# EAGLE design gateway (EAGLE 9.1.1)
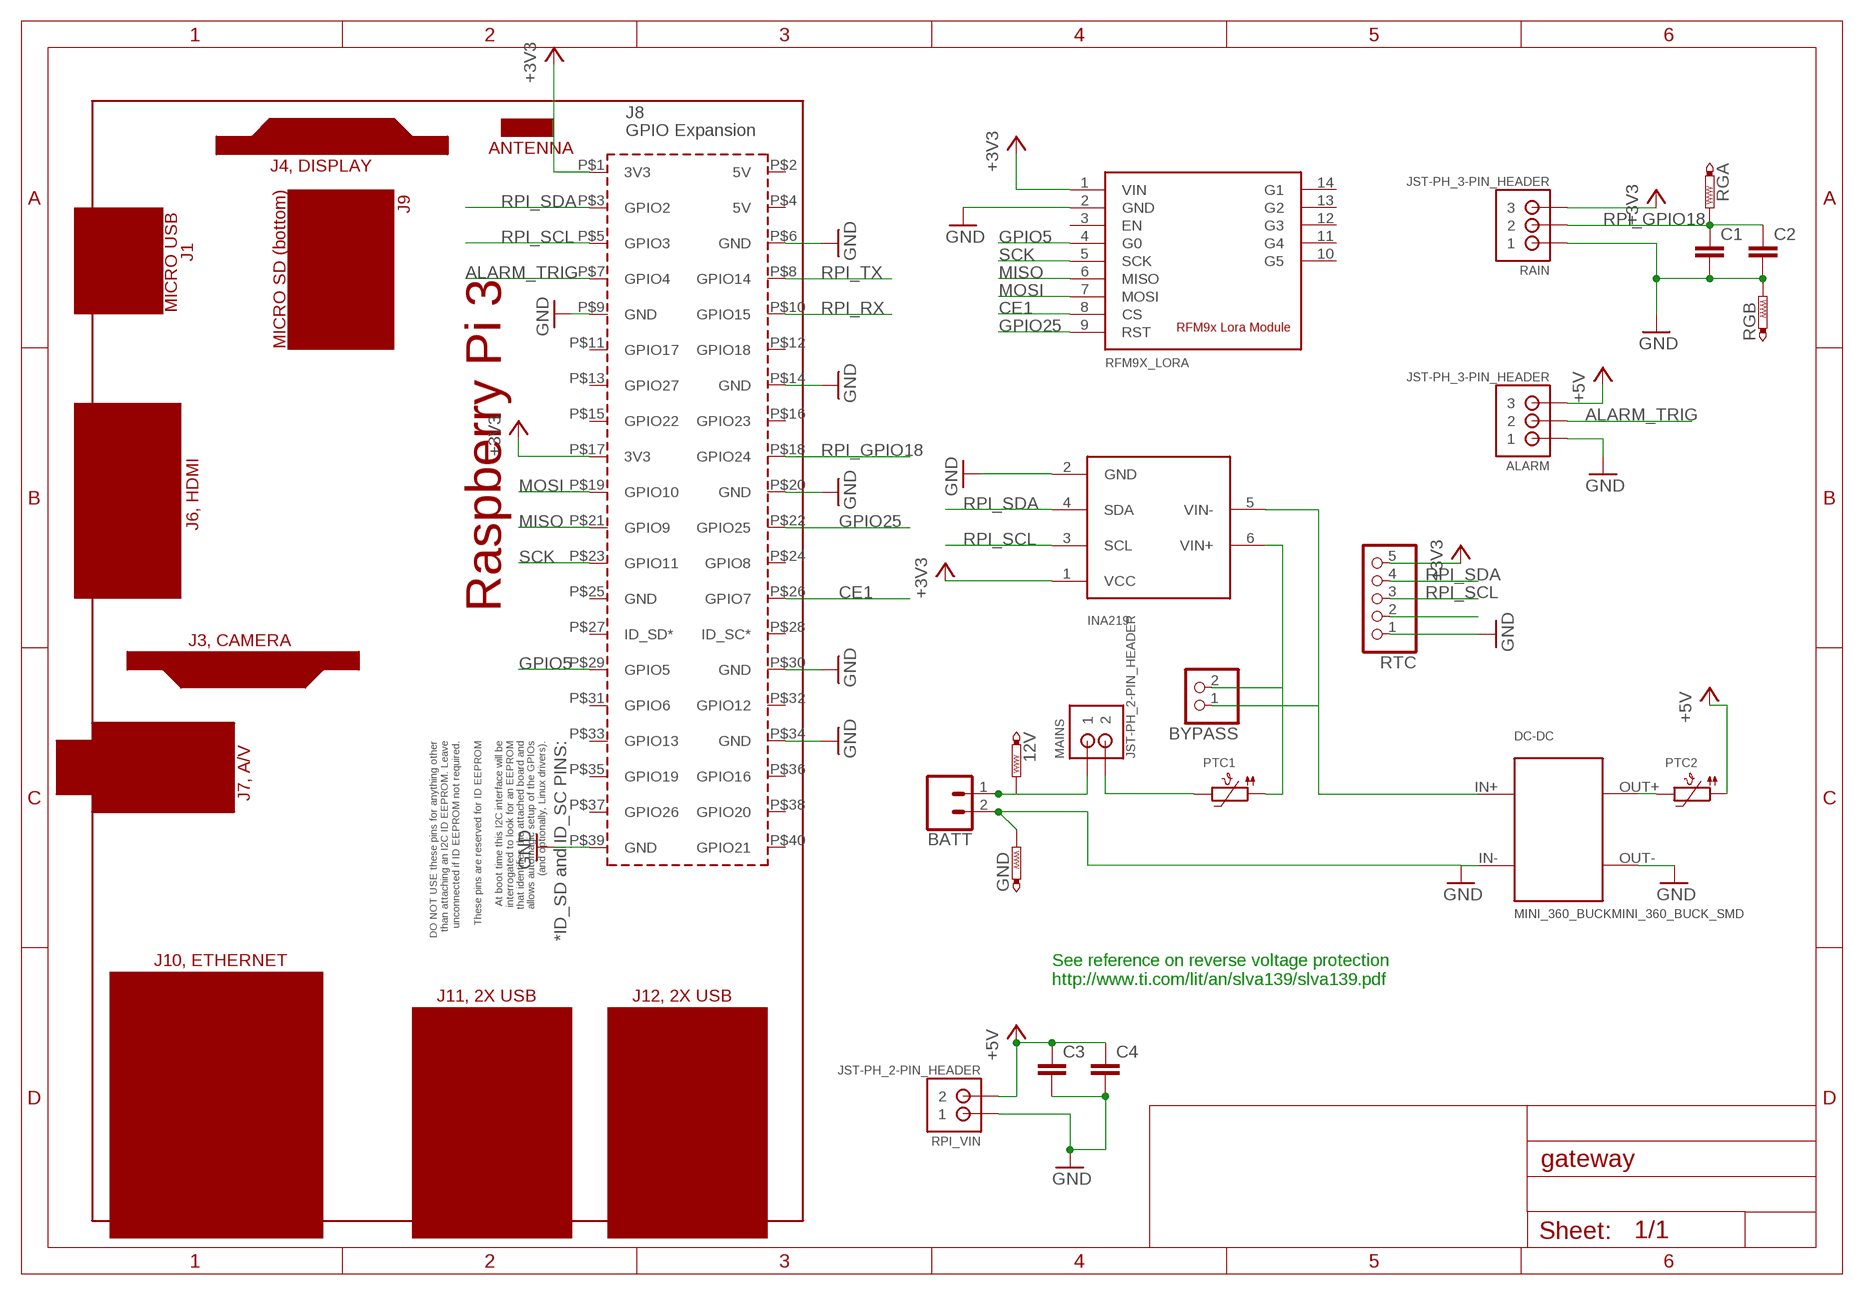
[diagram p0: schematic, sheet 1]

## Parts
12V  PTR1PAD1-13  [P1-13]
ALARM  JST-PH_3-PIN_HEADER  [JST_B3B-PH_HEADER]
BATT  CONN_02POLAR  [MOLEX-1X2]
BYPASS  PINHD-1X2  [1X02]
C1  C-EUC0805  [C0805]
C2  C-EUC0805  [C0805]
C3  C-EUC1210  [C1210]
C4  C-EUC2012  [C2012]
DC-DC  MINI_360_BUCKMINI_360_BUCK_SMD  [MINI_360_BUCK_SMD]
GND  PTR1PAD1-13  [P1-13]
INA219  INA219  [INA219]
MAINS  JST-PH_2-PIN_HEADER  [JST_B2B-PH_HEADER]
PCB2  RPI3  [RPI3]
PTC1  PTC1206  [1206]
PTC2  PTC1210  [PTC1210]
RAIN  JST-PH_3-PIN_HEADER  [JST_B3B-PH_HEADER]
RFM9X_LORA  RFM9X_MODULE  [RFM9X_MODULE]
RGA  PTR1PAD1-13  [P1-13]
RGB  PTR1PAD1-13  [P1-13]
RPI_VIN  JST-PH_2-PIN_HEADER  [JST_B2B-PH_HEADER]
RTC  PINHD-1X5  [1X05]

## Nets
+3V3: INA219.1(VCC) PCB2.P$1(3V3) PCB2.P$17(3V3) RAIN.P3 RFM9X_LORA.1(VIN) RTC.5
+5V: ALARM.P3 C3.1 C4.1 PTC2.P$1 RPI_VIN.P2
ALARM_TRIG: ALARM.P2 PCB2.P$7(GPIO4)
CE1: PCB2.P$26(GPIO7) RFM9X_LORA.8(CS)
GND: ALARM.P1 BATT.2 C1.2 C2.2 C3.2 C4.2 DC-DC.IN-(VIN-) DC-DC.OUT-(VOUT-) GND.TP INA219.2(GND) PCB2.P$6(GND) PCB2.P$9(GND) PCB2.P$14(GND) PCB2.P$20(GND) PCB2.P$30(GND) PCB2.P$34(GND) PCB2.P$39(GND) RAIN.P1 RFM9X_LORA.2(GND) RGB.TP RPI_VIN.P1 RTC.1
GPIO5: PCB2.P$29(GPIO5) RFM9X_LORA.4(G0)
GPIO25: PCB2.P$22(GPIO25) RFM9X_LORA.9(RST)
MISO: PCB2.P$21(GPIO9) RFM9X_LORA.6(MISO)
MOSI: PCB2.P$19(GPIO10) RFM9X_LORA.7(MOSI)
N$2: 12V.TP BATT.1 MAINS.P1
N$3: MAINS.P2 PTC1.2
N$4: RTC.2
N$5: BYPASS.1 DC-DC.IN+(VIN+) INA219.5(VIN-)
N$6: BYPASS.2 INA219.6(VIN+) PTC1.1
N$24: DC-DC.OUT+(VOUT+) PTC2.P$2
RPI_GPIO18: C1.1 C2.1 PCB2.P$18(GPIO24) RAIN.P2 RGA.TP
RPI_RX: PCB2.P$10(GPIO15)
RPI_SCL: INA219.3(SCL) PCB2.P$5(GPIO3) RTC.3
RPI_SDA: INA219.4(SDA) PCB2.P$3(GPIO2) RTC.4
RPI_TX: PCB2.P$8(GPIO14)
SCK: PCB2.P$23(GPIO11) RFM9X_LORA.5(SCK)
Unconnected: PCB2.P$2(5V) PCB2.P$4(5V) PCB2.P$11(GPIO17) PCB2.P$12(GPIO18) PCB2.P$13(GPIO27) PCB2.P$15(GPIO22) PCB2.P$16(GPIO23) PCB2.P$24(GPIO8) PCB2.P$25(GND) PCB2.P$27(ID_SD*) PCB2.P$28(ID_SC*) PCB2.P$31(GPIO6) PCB2.P$32(GPIO12) PCB2.P$33(GPIO13) PCB2.P$35(GPIO19) PCB2.P$36(GPIO16) PCB2.P$37(GPIO26) PCB2.P$38(GPIO20) PCB2.P$40(GPIO21) RFM9X_LORA.3(EN) RFM9X_LORA.10(G5) RFM9X_LORA.11(G4) RFM9X_LORA.12(G3) RFM9X_LORA.13(G2) RFM9X_LORA.14(G1)

## Notes on the sheet
- See reference on reverse voltage protection
  http://www.ti.com/lit/an/slva139/slva139.pdf

## Library data of the parts
12V GND RGA RGB = testpad:PTR1: TEST PIN
ALARM RAIN = SRG:JST-PH_3-PIN_HEADER: 3-pin JST PH Shrouded Header, top entry P/N B3B-PH-K-S Mating connector PHR-3
BATT = SparkFun-Connectors:CONN_02: Multi connection point. Often used as Generic Header-pin footprint for 0.1 inch spaced/style header connections On any of the 0.1 inch spaced packages, you can populate with these: Break Away Headers - Straight <https://www.sparkfun.com/products/116> (PRT-00116) Break Away Male Headers - Right Angle <https://www.sparkfun.com/products/553> (PRT-00553) Female Headers <https://www.sparkfun.com/products/115> (PRT-00115) Break Away Headers - Machine Pin <https://www.sparkfun.com/products/117> (PRT-00117) Break Away Female Headers - Swiss Machine Pin <https://www.sparkfun.com/products/743> (PRT-00743) For SCREWTERMINALS and SPRING TERMINALS visit here: Screw Terimnals on SparkFun.com <https://www.sparkfun.com/search/results?term=Screw+Terminals> (5mm/3.5mm/2.54mm spacing) This device is also useful as a general connection point to wire up your design to another part of your project. Our various solder wires solder well into these plated through hole pads. Hook-Up Wire - Assortment (Stranded, 22 AWG) <https://www.sparkfun.com/products/11375> (PRT-11375) Hook-Up Wire - Assortment (Solid Core, 22 AWG) <https://www.sparkfun.com/products/11367> (PRT-11367) View the entire wire category on our website here <https://www.sparkfun.com/categories/141> Special notes: Molex polarized connector foot print use with: PRT-08233 with associated crimp pins and housings. 2.54_SCREWTERM for use with PRT-10571. 3.5mm Screw Terminal footprints for PRT-08084 5mm Screw Terminal footprints for use with PRT-08432; SF_ID: PRT-09918
BYPASS = pinhead:PINHD-1X2: PIN HEADER
C1-C4 = rcl:C-EU: CAPACITOR, European symbol; SPICEPREFIX: C
DC-DC = edc_modules:MINI_360_BUCK
INA219 = edc_modules:INA219
MAINS RPI_VIN = SRG:JST-PH_2-PIN_HEADER: 2-pin JST PH Shrouded Header, top entry P/N B2B-PH-K-S Mating connector PHR-2 Mating cable assembly: Sparkfun PRT-09914 <http://www.sparkfun.com/products/9914>
PCB2 = e14_Rpi3_RevA:RPI3: Device for Raspberry Pi 3 board created by Dave Young for www.element14.com More information and support community is available at https://www.element14.com/community/community/raspberry-pi
PTC1 PTC2 = microbuilder:PTC: PTC (Resettable Fuse) 1206 Package 250mA PTC (16V Max, Time-to-Trip: 0.08s) - Digikey: F2110CT-ND 1210 Package 100mA PTC (30V Max, Time-to-Trip: 0.6s) - Digikey: MF-USMF010-2CT-ND 1812 Package 750mA PTC (24V Max, Time-to-Trip: 0.2s) - Digikey: MF-MSMF075/24-2CT-ND
RFM9X_LORA = edc_modules:RFM9X_MODULE
RTC = pinhead:PINHD-1X5: PIN HEADER

## Board
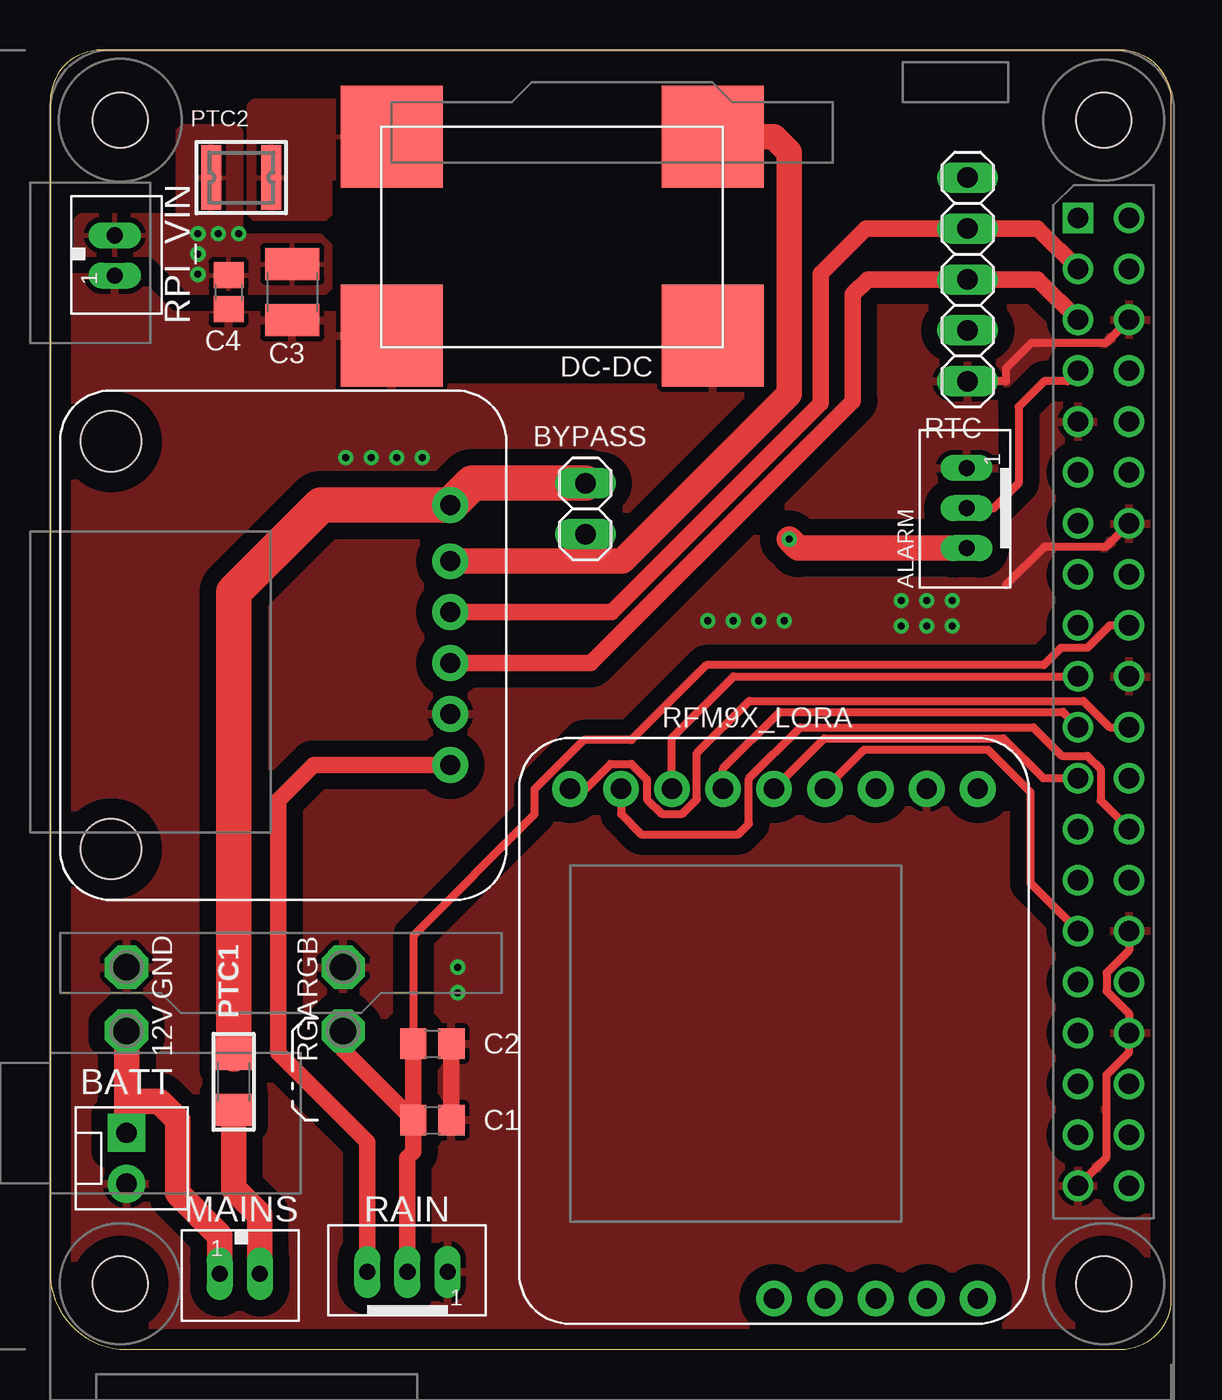
[diagram p1: board, top side]
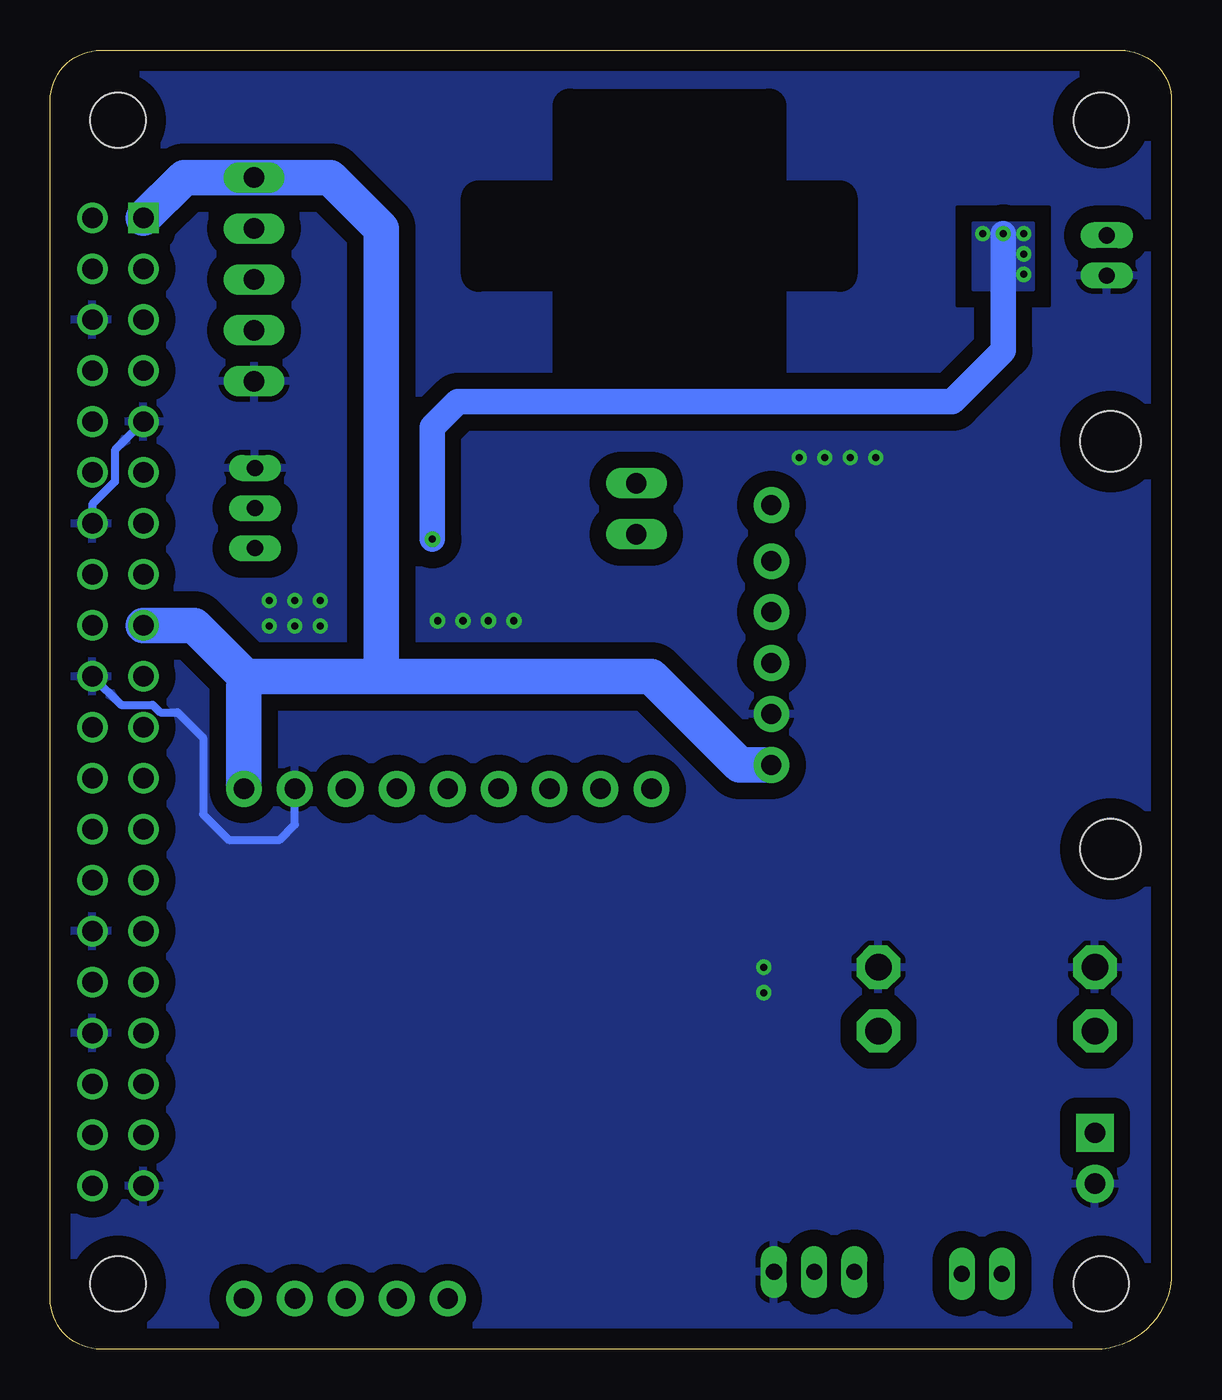
[diagram p2: board, bottom side, seen from below]

Size 55.88 x 64.77 mm. Coordinates in mm from the lower left corner, seen from the top.
Outline: 0,3.81 arc90 3.81,0 53.34,0 arc90 55.88,2.54 55.88,62.23 arc90 53.34,64.77 2.54,64.77 arc90 0,62.23 0,3.81
Copper layers (1*16): Top 0.035mm / dielectric 1.5mm / Bottom 0.035mm
Design rules "default": minimum track width 6mil, minimum drill 0.35mm, track to track 6mil, track to pad 6mil, pad to pad 6mil, via to via 6mil, smd to smd 6mil, copper to edge 40mil, drill to drill 6mil, minimum pad ring 10mil, minimum via ring 8mil, stop-mask expansion 4mil, vias tented up to drill 0mil, thermal gap 10mil

### Footprints (pad centres in the part's own frame; a part is rotated, then mirrored left to right if it is on the bottom)
P1-13 = drill 1.321 pad 2.159 octagon: TP 0,0
JST_B3B-PH_HEADER = drill 0.8 long: P1 2.027,0.048; P2 0.028,0.048; P3 -1.972,0.048
MOLEX-1X2 = drill 1.016 pad 1.88 square: 1 0,0 | drill 1.016 pad 1.88: 2 2.54,0
1X02 = drill 1.016 long: 1 -1.27,0; 2 1.27,0
C0805 = smd 1.3 x 1.5: 1 -0.95,0; 2 0.95,0
C1210 = smd 1.6 x 2.7: 1 -1.4,0; 2 1.4,0
C2012 = smd 1.3 x 1.5: 1 -0.85,0; 2 0.85,0
MINI_360_BUCK_SMD = smd 5.08 x 5.08: IN+ -4.572,7.62; IN- 5.334,7.62; OUT+ -4.572,-8.382; OUT- 5.334,-8.382
INA219 = drill 1 pad 1.778: 1 6.731,2.794; 2 9.271,2.794; 3 11.811,2.794; 4 14.351,2.794; 5 16.891,2.794; 6 19.685,2.794 | hole 3: 2.54,19.7; 22.86,19.7
JST_B2B-PH_HEADER = drill 0.8 long: P1 1.075,0.048; P2 -0.925,0.048
RPI3 = drill 1.016 square: P$1 8.37,51.23 | drill 1.016: P$2 8.357,53.772; P$3 10.897,51.232; P$4 10.897,53.772; P$5 13.437,51.232; P$6 13.437,53.772; P$7 15.977,51.232; P$8 15.977,53.772; P$9 18.517,51.232; P$10 18.517,53.772; P$11 21.057,51.232; P$12 21.057,53.772; P$13 23.597,51.232; P$14 23.597,53.772; P$15 26.137,51.232; P$16 26.137,53.772; P$17 28.677,51.232; P$18 28.677,53.772; P$19 31.217,51.232; P$20 31.217,53.772; P$21 33.757,51.232; P$22 33.757,53.772; P$23 36.297,51.232; P$24 36.297,53.772; P$25 38.837,51.232; P$26 38.837,53.772; P$27 41.377,51.232; P$28 41.377,53.772; P$29 43.917,51.232; P$30 43.917,53.772; P$31 46.457,51.232; P$32 46.457,53.772; P$33 48.997,51.232; P$34 48.997,53.772; P$35 51.537,51.232; P$36 51.537,53.772; P$37 54.077,51.232; P$38 54.077,53.772; P$39 56.617,51.232; P$40 56.617,53.772 | hole 2.75: 3.5,3.5; 61.5,3.5; 3.5,52.5; 61.5,52.5
1206 = smd 1.6 x 1.8: 1 -1.4,0; 2 1.4,0
PTC1210 = smd 1 x 3.2: P$1 -1.5,0; P$2 1.5,0
RFM9X_MODULE = drill 1.016 pad 1.778: 1 2.54,2.54; 2 5.08,2.54; 3 7.62,2.54; 4 10.16,2.54; 5 12.7,2.54; 6 15.24,2.54; 7 17.78,2.54; 8 20.32,2.54; 9 22.86,2.54; 10 12.7,27.94; 11 10.16,27.94; 12 7.62,27.94; 13 5.08,27.94; 14 2.54,27.94
1X05 = drill 1.016 long: 1 -5.08,0; 2 -2.54,0; 3 0,0; 4 2.54,0; 5 5.08,0

### Placement (x,y rotation side)
12V  3.81,15.88 0 top
ALARM  45.72,41.91 90 top
BATT  3.81,10.79 270 top
BYPASS  26.67,41.91 90 top
C1  19.05,11.43 0 top
C2  19.05,15.24 0 top
C3  12.06,52.7 270 top
C4  8.89,52.7 270 top
DC-DC  25.4,55.88 270 top
GND  3.81,19.05 0 top
INA219  22.73,22.4 90 top
MAINS  9.53,3.81 180 top
PCB2  0,64.77 270 top
PTC1  9.14,13.34 270 top
PTC2  9.53,58.42 0 top
RAIN  17.78,3.81 0 top
RFM9X_LORA  48.77,30.48 180 top
RGA  14.61,15.88 0 top
RGB  14.61,19.05 0 top
RPI_VIN  3.17,54.61 270 top
RTC  45.72,53.34 90 top

### Tracks (layer width: path | path; a pad name or v marks a point on that pad's centre or on a via)
+3V3
  Top 0.813: 19.86,29.06 INA219.1 13.12,29.13 11.36,27.37 11.36,14.79 15.81,10.34 RAIN.P3
  Bottom 1.778: PCB2.P$1 49.21,58.42 RTC.5 41.91,58.42 39.37,55.88 39.37,37.36 39.37,33.55 | INA219.1 21.51,29.13 25.93,33.55 39.37,33.55 | 45.72,33.55 46.15,33.55 48.69,36.09 PCB2.P$17 | 45.72,33.55 40.64,33.55 39.37,33.55 | RFM9X_LORA.1 46.23,33.05 45.72,33.55
+5V  (via drill 0.35)
  Top 1.27: ALARM.P3 37.28,39.94 v36.83,40.39
  Bottom 1.27: v36.83,40.39 36.83,45.97 35.56,47.24 10.92,47.24 8.38,49.78 v8.38,55.63
  other vias: 7.37,55.63 9.4,55.63 7.37,54.61 7.37,53.59
  pour Top (isolate 0.254): 6.35,56.52 1.52,56.52 1.27,56.26 1.27,54.86 1.52,54.61 5.08,54.61 6.99,52.7 13.72,52.7 13.97,52.96 13.97,54.99 13.46,55.5 9.53,55.5 9.53,60.71 9.27,60.96 6.6,60.96 6.35,60.71
  pour Bottom: 6.86,56.13 9.91,56.13 9.91,52.83 6.86,52.83
ALARM_TRIG
  Top 0.406: PCB2.P$7 50.7,48.26 49.53,48.26 48.26,46.99 48.26,43.18 47.02,41.94 ALARM.P2
CE1
  Top 0.406: PCB2.P$26 52.35,27.36 52.35,28.94 51.7,29.59 50.42,29.59 49,31.01 37.38,31.01 34.82,28.46 34.82,26.2 34.3,25.68 29.46,25.68 28.45,26.69 RFM9X_LORA.8
GND  (via drill 0.35)
  Top 0.406: PCB2.P$30 53.77,19.89 52.65,18.78 52.65,17.85 53.77,16.73 PCB2.P$34 53.77,14.81 52.65,13.7 52.65,9.58 PCB2.P$39 | PCB2.P$14 52.6,40.01 49.53,40.01 47.62,38.1 | PCB2.P$6 52.6,50.16 48.9,50.16 47.62,48.9 47.62,48.26 RTC.1
  Top 0.813: C1.2 C2.2
  Bottom 0.406: PCB2.P$9 52.65,44.83 52.65,43.25 53.77,42.13 PCB2.P$14 | PCB2.P$20 52.35,32.13 50.77,32.13 50.39,31.75 49.53,31.75 48.26,30.48 48.26,26.67 46.99,25.4 44.45,25.4 43.69,26.16 RFM9X_LORA.2
  other vias: 14.73,44.45 16,44.45 17.27,44.45 18.54,44.45 44.96,36.07 43.69,36.07 43.69,37.34 44.96,37.34 20.32,17.78 20.32,19.05 42.42,37.34 42.42,36.07 32.77,36.32 34.04,36.32 35.31,36.32 36.58,36.32
  pour Top (isolate 0.813, rank 6): 0,0 0,62.23 arc-90 2.54,64.77 53.34,64.77 arc-90 55.88,62.23 55.88,2.54 arc-90 53.34,0
  pour Bottom (isolate 0.813, rank 6): 0,4.32 0,64.77 53.34,64.77 arc-90 55.88,62.23 55.88,2.54 arc-90 53.34,0 4.32,0 arc-90
GPIO5
  Top 0.406: RFM9X_LORA.4 40.56,29.9 46.74,29.9 48.84,27.79 48.84,25.13 48.84,23.24 PCB2.P$29
GPIO25
  Top 0.406: RFM9X_LORA.9 26.69,27.94 27.93,29.18 28.96,29.18 29.74,28.41 29.74,27.42 30.47,26.7 31.5,26.7 32.23,27.42 32.23,29.72 34.85,32.33 51.49,32.33 52.81,31.01 PCB2.P$22
MISO
  Top 0.406: PCB2.P$21 50.47,31.77 36.35,31.77 33.53,28.96 RFM9X_LORA.6
MOSI
  Top 0.406: PCB2.P$19 34.06,33.55 30.99,30.48 RFM9X_LORA.7
N$2
  Top 1.27: 3.81,12.36 5.42,12.36 6.35,11.43 6.35,7.77 8.45,5.67 MAINS.P1 | 12V.TP 3.81,12.36 | 3.81,12.36 BATT.1
N$3
  Top 1.27: MAINS.P2 10.45,6.7 9.14,8 PTC1.2
N$5
  Top 1.27: DC-DC.IN+ 36.07,60.45 36.83,59.69 36.83,47.62 28.5,39.29 27.94,39.29 26.67,39.29 | BYPASS.1 26.67,39.29 | INA219.5 26.67,39.29
N$6
  Top 1.778: BYPASS.2 21.03,43.18 INA219.6 13.48,42.09 9.14,37.76 PTC1.1
N$24
  pour Top (rank 2): 15.88,62.23 10.16,62.23 9.91,61.98 9.91,56.64 10.16,56.39 13.72,56.39 13.97,56.64 13.97,58.42 15.88,58.42
RPI_GPIO18
  Top 0.406: PCB2.P$18 52.81,36.09 51.7,34.98 50.37,34.98 49.51,34.11 32.7,34.11 28.97,30.38 26.59,30.38 24.13,27.92 24.13,26.67 18.1,20.62 C2.1
  Top 0.813: C1.1 C2.1 | RGA.TP 14.61,14.93 C1.1 | C1.1 18.1,9.84 17.81,9.55 RAIN.P2
RPI_SCL
  Top 0.813: PCB2.P$5 49.23,53.34 RTC.3 40.75,53.34 40.01,52.6 40.01,47.28 26.93,34.21 INA219.3
RPI_SDA
  Top 0.813: PCB2.P$3 49.23,55.88 RTC.4 40.65,55.88 38.41,53.63 38.41,49.53 38.41,47.18 27.98,36.75 INA219.4
SCK
  Top 0.406: RFM9X_LORA.5 38.58,30.45 47.5,30.45 49.48,28.47 PCB2.P$23

### Text on the board
_tNames: OUT | IN | Slope Monitoring / Gateway Board V3